# Altium schematic sheet GTM_BallGrippersFototransistorsConnectors.SchDoc
size A4
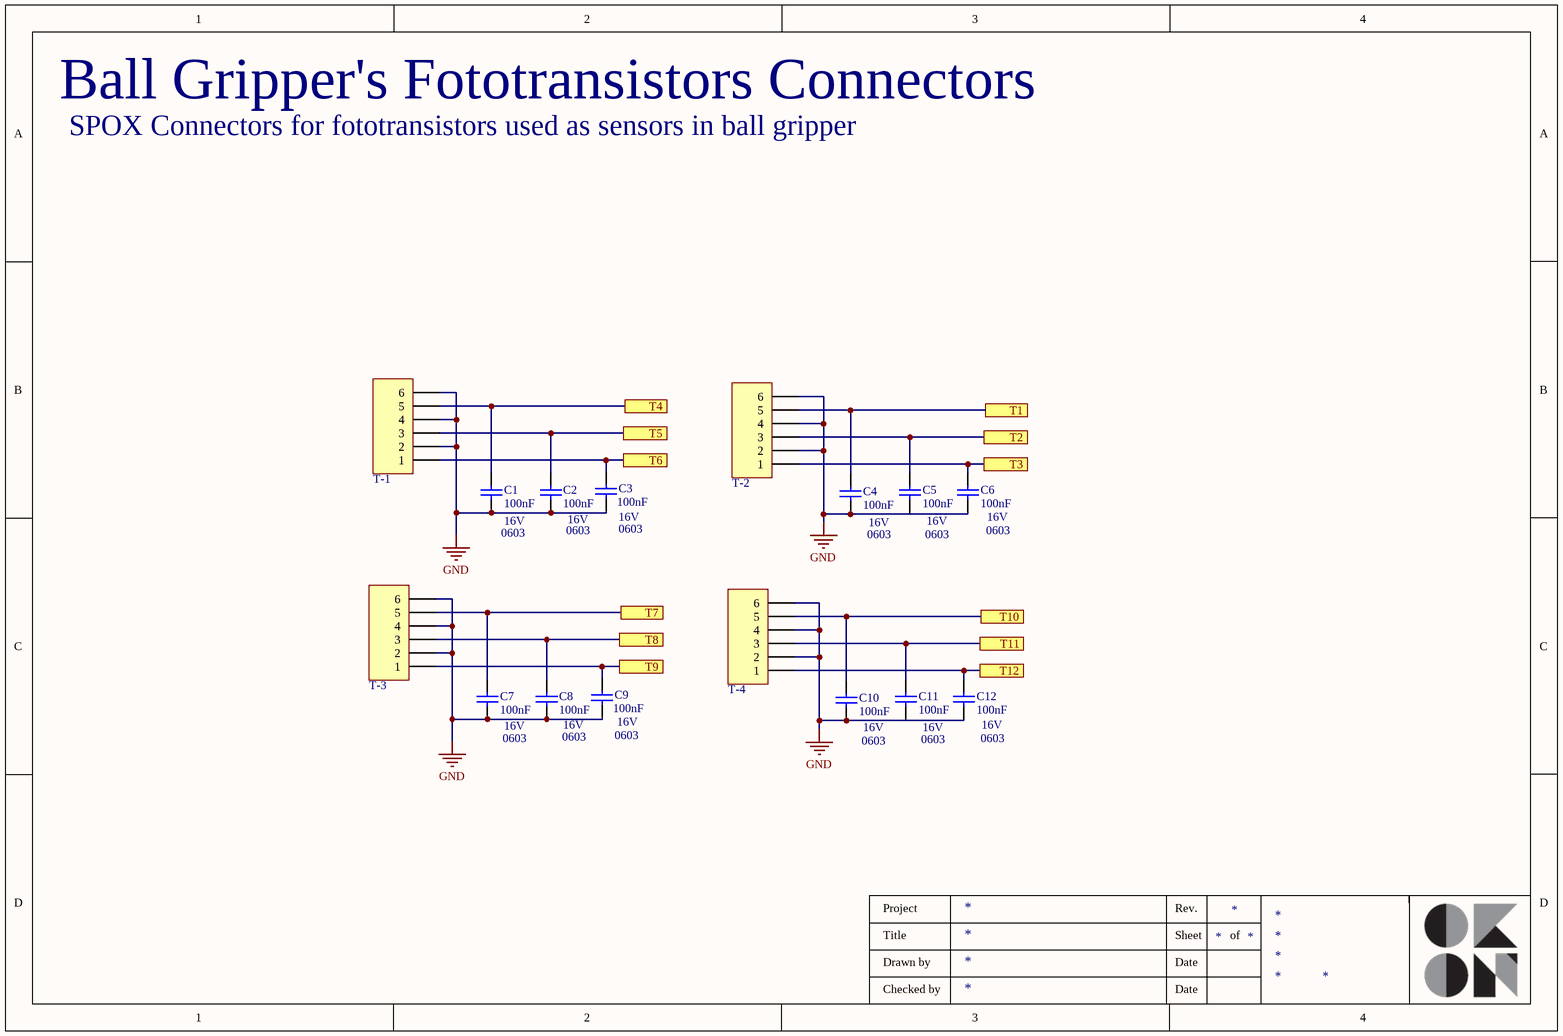
[diagram p0: GTM_BallGrippersFototransistorsConnectors.SchDoc]

## Parts
C1  value 100nF  Package: 0603  Capacity: 16V  [0603_CAP]  (hidden comment: Cap)
C2  value 100nF  Package: 0603  Capacity: 16V  [0603_CAP]  (hidden comment: Cap)
C3  value 100nF  Package: 0603  Capacity: 16V  [0603_CAP]  (hidden comment: Cap)
C4  value 100nF  Package: 0603  Capacity: 16V  [0603_CAP]  (hidden comment: Cap)
C5  value 100nF  Package: 0603  Capacity: 16V  [0603_CAP]  (hidden comment: Cap)
C6  value 100nF  Package: 0603  Capacity: 16V  [0603_CAP]  (hidden comment: Cap)
C7  value 100nF  Package: 0603  Capacity: 16V  [0603_CAP]  (hidden comment: Cap)
C8  value 100nF  Package: 0603  Capacity: 16V  [0603_CAP]  (hidden comment: Cap)
C9  value 100nF  Package: 0603  Capacity: 16V  [0603_CAP]  (hidden comment: Cap)
C10  value 100nF  Package: 0603  Capacity: 16V  [0603_CAP]  (hidden comment: Cap)
C11  value 100nF  Package: 0603  Capacity: 16V  [0603_CAP]  (hidden comment: Cap)
C12  value 100nF  Package: 0603  Capacity: 16V  [0603_CAP]  (hidden comment: Cap)
T-1  HDR1X6  [Molex SPOX Horizontal 6 Circuits]  (value not drawn)
T-2  HDR1X6  [Molex SPOX Horizontal 6 Circuits]  (value not drawn)
T-3  HDR1X6  [Molex SPOX Horizontal 6 Circuits]  (value not drawn)
T-4  HDR1X6  [Molex SPOX Horizontal 6 Circuits]  (value not drawn)

## Ports
T1, T2, T3, T4, T5, T6, T7, T8, T9, T10, T11, T12

## Nets
GND: C1.1 C2.1 C3.1 C4.1 C6.1 C7.1 C8.1 C9.1 C10.1 C12.1 T-1.2 T-1.4 T-1.6 T-2.2 T-2.4 T-2.6 T-3.2 T-3.4 T-3.6 T-4.2 T-4.4 T-4.6
T1: C4.2 T-2.5 ; port T1
T2: C5.2 T-2.3 ; port T2
T3: C6.2 T-2.1 ; port T3
T4: C1.2 T-1.5 ; port T4
T5: C2.2 T-1.3 ; port T5
T6: C3.2 T-1.1 ; port T6
T7: C7.2 T-3.5 ; port T7
T8: C8.2 T-3.3 ; port T8
T9: C9.2 T-3.1 ; port T9
T10: C10.2 T-4.5 ; port T10
T11: C11.2 T-4.3 ; port T11
T12: C12.2 T-4.1 ; port T12

Not connected (* = marked no-connect by the designer): C5 1; C11 1

## Notes on the sheet
- Ball Gripper's Fototransistors Connectors
- SPOX Connectors for fototransistors used as sensors in ball gripper
- Project
- Rev.
- Title
- Drawn by
- Date
- Sheet
- of
- Checked by

## Library data of the parts
C1-C12 = Cap: Ceramic capacitor
T-1-T-4 = HDR1X6: Header, 6-Pin; LatestRevisionDate: 17-Jul-2002; LatestRevisionNote: Re-released for DXP Platform.; Publisher: Altium Limited